# Altium schematic sheet breeze_motor.SchDoc: Breeze Quadcopter
size A4; Author: myyerrol; Organization: Team MicroDynamics; Address1: NWPU; Address2: Xi'an; Address3: Shannxi; Address4: China; Revision: V0.1; SheetNumber: 2; SheetTotal: 5
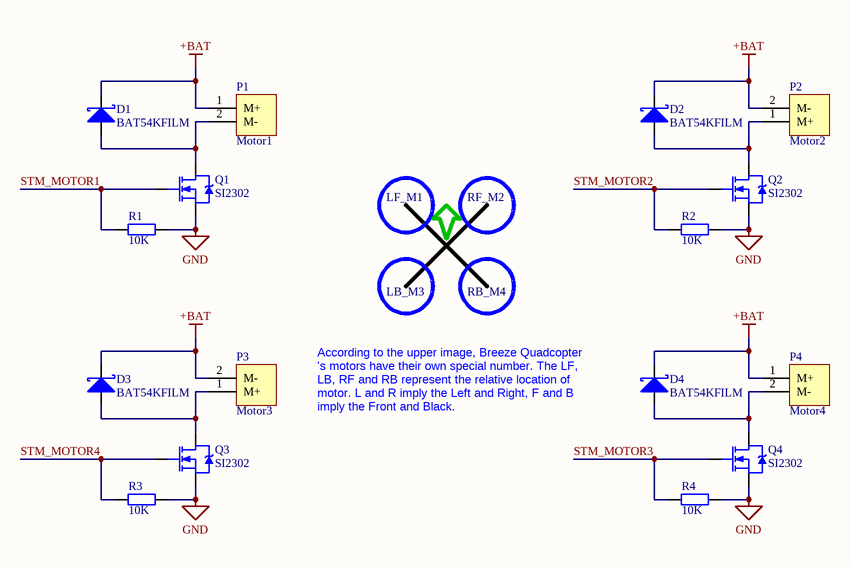
[diagram p0: breeze_motor.SchDoc]

## Parts
D1  BAT54KFILM  [SOD-523]
D2  BAT54KFILM  [SOD-523]
D3  BAT54KFILM  [SOD-523]
D4  BAT54KFILM  [SOD-523]
P1  Motor1  [HDRM-1X2]
P2  Motor2  [HDRM-1X2]
P3  Motor3  [HDRM-1X2]
P4  Motor4  [HDRM-1X2]
Q1  SI2302  [SOT-23]
Q2  SI2302  [SOT-23]
Q3  SI2302  [SOT-23]
Q4  SI2302  [SOT-23]
R1  value 10K  [SMD-0603]  (hidden comment: RES-0603)
R2  value 10K  [SMD-0603]  (hidden comment: RES-0603)
R3  value 10K  [SMD-0603]  (hidden comment: RES-0603)
R4  value 10K  [SMD-0603]  (hidden comment: RES-0603)

## Nets
+BAT: D1.2(K) D2.2(K) D3.2(K) D4.2(K) P1.1(M+) P2.2(M-) P3.2(M-) P4.1(M+)
GND: Q1.2(S) Q2.2(S) Q3.2(S) Q4.2(S) R1.2 R2.2 R3.2 R4.2
STM_MOTOR1: Q1.1(G) R1.1
STM_MOTOR2: Q2.1(G) R2.1
STM_MOTOR3: Q4.1(G) R4.1
STM_MOTOR4: Q3.1(G) R3.1
NetD1_1: D1.1(A) P1.2(M-) Q1.3(D)
NetD2_1: D2.1(A) P2.1(M+) Q2.3(D)
NetD3_1: D3.1(A) P3.1(M+) Q3.3(D)
NetD4_1: D4.1(A) P4.2(M-) Q4.3(D)

## Notes on the sheet
- LF_M1
- RF_M2
- LB_M3
- RB_M4
- According to the upper image, Breeze Quadcopter 's motors have their own special number. The LF, LB, RF and RB represent the relative location of motor. L and R imply the Left and Right, F and B  imply the Front and Black.
- Title
- Size:
- Date:
- A4
- Author:
- Time:
- Revision:
- Sheet
- of
- File:

## Library data of the parts
D1-D4 = BAT54KFILM: Schottky Diode
P1 P4 = Motor_A: Motor Header
P2 P3 = Motor_B: Motor Header
Q1-Q4 = SI2302: N-Channel Enhancement Mode Field Effect Transistor
R1-R4 = RES-0603: Resistor